# Altium schematic sheet AMC-SATA.SchDoc: AMC FMC Carrier v4
size A4; CompanyName: WUT; Organization: WUT ISE; Address1: Warsaw Univeristy of Technology; Address2: Nowowiejska 15/19 00-665 Warsaw; Address3: t.przywozki@gmail.com; Revision: 1; SheetNumber: 25; SheetTotal: 29; Project: AMC FMC Carrier v4; ModifiedBy: -; CreateDate: XX/XX/XXXX; CheckedDate: -; Title2: AMC - SATA; DivGrp: ISE; Designer: T. Przywozki; ModifiedDate: -; ProjectName: ADC/DAC MEZZANINE
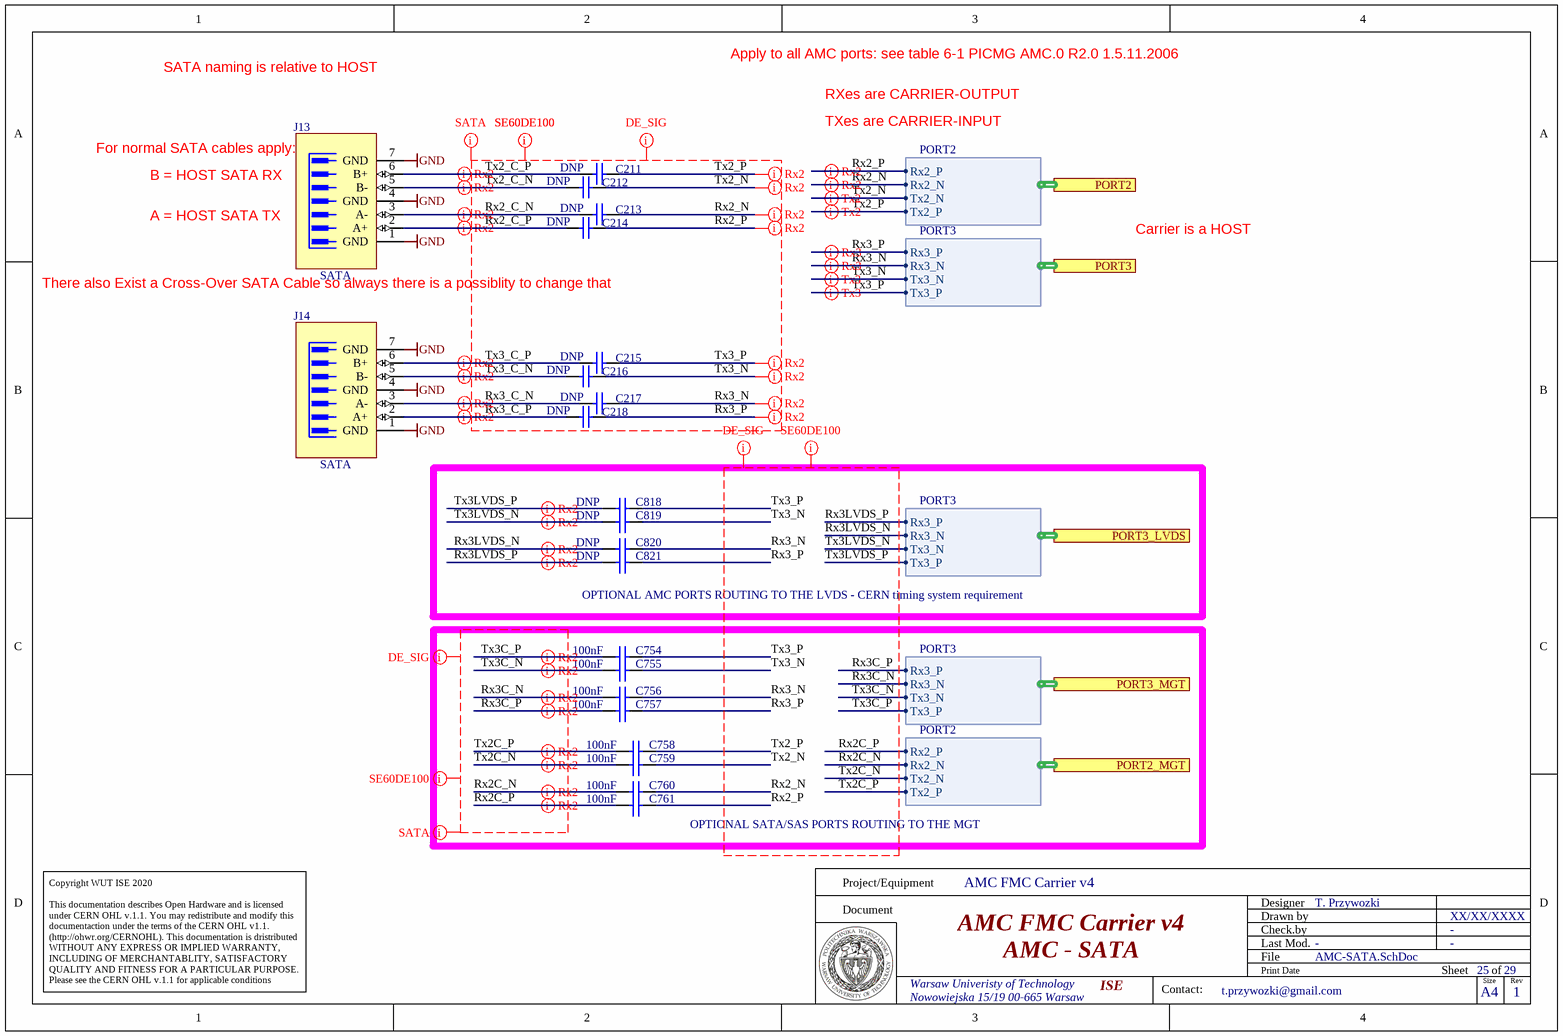
[diagram p0: AMC-SATA.SchDoc]

## Parts
C211  DNP  [CAPC0603X33N]
C212  DNP  [CAPC0603X33N]
C213  DNP  [CAPC0603X33N]
C214  DNP  [CAPC0603X33N]
C215  DNP  [CAPC0603X33N]
C216  DNP  [CAPC0603X33N]
C217  DNP  [CAPC0603X33N]
C218  DNP  [CAPC0603X33N]
C754  100nF  [CAPC0603X33N]
C755  100nF  [CAPC0603X33N]
C756  100nF  [CAPC0603X33N]
C757  100nF  [CAPC0603X33N]
C758  100nF  [CAPC0603X33N]
C759  100nF  [CAPC0603X33N]
C760  100nF  [CAPC0603X33N]
C761  100nF  [CAPC0603X33N]
C818  DNP  [CAPC0603X33N]
C819  DNP  [CAPC0603X33N]
C820  DNP  [CAPC0603X33N]
C821  DNP  [CAPC0603X33N]
J13  SATA  [MOLEX_67800-5005]
J14  SATA  [MOLEX_67800-5005]

## Blocks framed on the sheet
OPTIONAL SATA/SAS PORTS ROUTING TO THE MGT: C754-C761

## Ports
PORT2 (harness PORT2), PORT2_MGT (harness PORT2), PORT3 (harness PORT3), PORT3_LVDS (harness PORT3), PORT3_MGT (harness PORT3)

## Harnesses
PORT2: Rx2_P, Rx2_N, Tx2_N, Tx2_P
PORT3: Rx3_P, Rx3_N, Tx3_N, Tx3_P

## Nets
GND: J13.1(GND) J13.4(GND) J13.7(GND) J14.1(GND) J14.4(GND) J14.7(GND)
Rx2_C_N: C213.1 J13.3(A-)
Rx2_C_P: C214.1 J13.2(A+)
Rx2_N: C213.2 C760.2 ; port PORT2.Rx2_N
Rx2_P: C214.2 C761.2 ; port PORT2.Rx2_P
Rx2C_N: C760.1 ; port PORT2_MGT.Rx2_N
Rx2C_P: C761.1 ; port PORT2_MGT.Rx2_P
Rx3_C_N: C217.1 J14.3(A-)
Rx3_C_P: C218.1 J14.2(A+)
Rx3_N: C217.2 C756.2 C820.2 ; port PORT3.Rx3_N
Rx3_P: C218.2 C757.2 C821.2 ; port PORT3.Rx3_P
Rx3C_N: C756.1 ; port PORT3_MGT.Rx3_N
Rx3C_P: C757.1 ; port PORT3_MGT.Rx3_P
Rx3LVDS_N: C820.1 ; port PORT3_LVDS.Rx3_N
Rx3LVDS_P: C821.1 ; port PORT3_LVDS.Rx3_P
Tx2_C_N: C212.1 J13.5(B-)
Tx2_C_P: C211.1 J13.6(B+)
Tx2_N: C212.2 C759.2 ; port PORT2.Tx2_N
Tx2_P: C211.2 C758.2 ; port PORT2.Tx2_P
Tx2C_N: C759.1 ; port PORT2_MGT.Tx2_N
Tx2C_P: C758.1 ; port PORT2_MGT.Tx2_P
Tx3_C_N: C216.1 J14.5(B-)
Tx3_C_P: C215.1 J14.6(B+)
Tx3_N: C216.2 C755.2 C819.2 ; port PORT3.Tx3_N
Tx3_P: C215.2 C754.2 C818.2 ; port PORT3.Tx3_P
Tx3C_N: C755.1 ; port PORT3_MGT.Tx3_N
Tx3C_P: C754.1 ; port PORT3_MGT.Tx3_P
Tx3LVDS_N: C819.1 ; port PORT3_LVDS.Tx3_N
Tx3LVDS_P: C818.1 ; port PORT3_LVDS.Tx3_P

## Layout directives
differential pair: Rx2_C_N, Rx2_C_P, Rx2_N, Rx2_P, Rx2C_N, Rx2C_P, Rx3_C_N, Rx3_C_P, Rx3_N, Rx3_P, Rx3C_N, Rx3C_P, Rx3LVDS_N, Rx3LVDS_P, Tx2_C_N, Tx2_C_P, Tx2_N, Tx2_P, Tx2C_N, Tx2C_P, Tx3_C_N, Tx3_C_P, Tx3_N, Tx3_P, Tx3C_N, Tx3C_P, Tx3LVDS_N, Tx3LVDS_P
net class SATA: Rx2_C_N, Rx2_C_P, Rx2_N, Rx2_P, Rx2C_N, Rx2C_P, Rx3_C_N, Rx3_C_P, Rx3_N, Rx3_P, Rx3C_N, Rx3C_P, Tx2_C_N, Tx2_C_P, Tx2_N, Tx2_P, Tx2C_N, Tx2C_P, Tx3_C_N, Tx3_C_P, Tx3_N, Tx3_P, Tx3C_N, Tx3C_P
net class SE60DE100: Rx2_C_N, Rx2_C_P, Rx2_N, Rx2_P, Rx2C_N, Rx2C_P, Rx3_C_N, Rx3_C_P, Rx3_N, Rx3_P, Rx3C_N, Rx3C_P, Rx3LVDS_N, Rx3LVDS_P, Tx2_C_N, Tx2_C_P, Tx2_N, Tx2_P, Tx2C_N, Tx2C_P, Tx3_C_N, Tx3_C_P, Tx3_N, Tx3_P, Tx3C_N, Tx3C_P, Tx3LVDS_N, Tx3LVDS_P
net class DE_SIG: Rx2_C_N, Rx2_C_P, Rx2_N, Rx2_P, Rx2C_N, Rx2C_P, Rx3_C_N, Rx3_C_P, Rx3_N, Rx3_P, Rx3C_N, Rx3C_P, Rx3LVDS_N, Rx3LVDS_P, Tx2_C_N, Tx2_C_P, Tx2_N, Tx2_P, Tx2C_N, Tx2C_P, Tx3_C_N, Tx3_C_P, Tx3_N, Tx3_P, Tx3C_N, Tx3C_P, Tx3LVDS_N, Tx3LVDS_P
net class SE60DE101: Rx2_C_N, Rx2_C_P, Rx2_N, Rx2_P, Rx3_C_N, Rx3_C_P, Rx3_N, Rx3_P, Tx2_C_N, Tx2_C_P, Tx2_N, Tx2_P, Tx3_C_N, Tx3_C_P, Tx3_N, Tx3_P

## Notes on the sheet
- SATA naming is relative to HOST
- Apply to all AMC ports: see table 6-1 PICMG AMC.0 R2.0 1.5.11.2006
- RXes are CARRIER-OUTPUT
- For normal SATA cables apply:
- B = HOST SATA RX
- TXes are CARRIER-INPUT
- A = HOST SATA TX
- Carrier is a HOST
- There also Exist a Cross-Over SATA Cable so always there is a possiblity to change that
- OPTIONAL AMC PORTS ROUTING TO THE LVDS - CERN timing system requirement
- Project/Equipment
- Document
- Designer
- Drawn by
- Check.by
- Copyright WUT ISE 2020
  This documentation describes Open Hardware and is licensed under CERN OHL v.1.1. You may redistribute and modify this documentaction under the terms of the CERN OHL v1.1.
  (http://ohwr.org/CERNOHL). This documentation is dristributed WITHOUT ANY EXPRESS OR IMPLIED WARRANTY, INCLUDING OF MERCHANTABLITY, SATISFACTORY QUALITY AND FITNESS FOR A PARTICULAR PURPOSE. Please see the CERN OHL v.1.1 for applicable conditions
- File
- Last Mod.
- Print Date
- Sheet
- Size
- A4
- of
- Rev
- Contact:

## Library data of the parts
C211-C218 C818-C821 = CC0201_100NF_6.3V_10%_X5R: Non-polarised capacitor; Part Description: SMD Multilayer Chip Ceramic Capacitor; Manufacturer: GENERIC; Manufacturer1 Part Number: 02016D104KAT2A; Value: 100nF; Voltage: 6.3V; TC: X5R; Tolerance: ±10%; Table: Capacitors SMD; Part Number: CC0201_100NF_6.3V_10%_X5R; Component Kind: Standard; Component Type: Standard; Pin Count: 2; Status: Not Recommended; Manufacturer Part Number: CC0201_100NF_6.3V_10%_X5R; Case: 0201; Mounted: Yes; Socket: No; SMD: Yes; Manufacturer1 Example: AVX; Manufacturer1 ComponentHeight: 0.33mm; HelpURL: \\cern.ch\dfs\Applications\Altium\Datasheets\CC0201_X5R_AVX.pdf; Author: CERN DEM JLC; CreateDate: 2007-12-03; LatestRevisionDate: 2007-12-03
C754-C761 = CC0201_100NF_6.3V_10%_X5R: Non-polarised capacitor; Part Description: SMD Multilayer Chip Ceramic Capacitor; Manufacturer: GENERIC; Manufacturer1 Part Number: 02016D104KAT2A; Voltage: 6.3V; TC: X5R; Tolerance: ±10%; Table: Capacitors SMD; Part Number: CC0201_100NF_6.3V_10%_X5R; Component Kind: Standard; Component Type: Standard; Pin Count: 2; Value: 100nF; Status: Not Recommended; Manufacturer Part Number: CC0201_100NF_6.3V_10%_X5R; Case: 0201; Mounted: Yes; Socket: No; SMD: Yes; Manufacturer1 Example: AVX; Manufacturer1 ComponentHeight: 0.33mm; HelpURL: \\cern.ch\dfs\Applications\Altium\Datasheets\CC0201_X5R_AVX.pdf; Author: CERN DEM JLC; CreateDate: 2007-12-03; LatestRevisionDate: 2007-12-03
J13 J14 = MOLEX_67800-5005: 7 Pin SATA Receptacle; Part Description: 1.27mm Pitch, 7 Contacts, Serial ATA High Speed Header, Straight with Locking Latch; Manufacturer: MOLEX; PressFit: No; Part Number: MOLEX_67800-5005; Component Kind: Standard; Component Type: Standard; Pin Count: 7; Family: SATA; Mounted: Yes; Socket: No; SMD: Yes; Sense: No; Status: None; Manufacturer Part Number: 67800-5005; ComponentHeight: 8.4mm; HelpURL: \\cern.ch\dfs\Applications\Altium\Datasheets\MOLEX_67800-5005.pdf; Author: CERN DEM MR; CreateDate: 01.12.2016; LatestRevisionDate: 01.12.2016